# Altium schematic sheet ESP8862.SchDoc
size A4; SheetNumber: 3
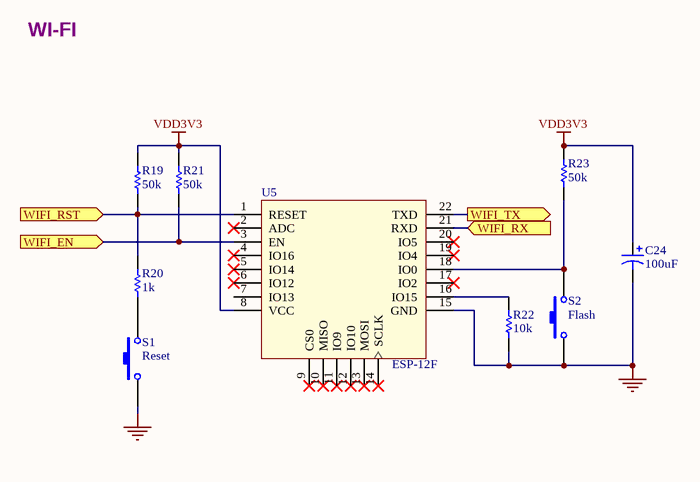
[diagram p0: ESP8862.SchDoc]

## Parts
C24  100uF  [AVX-B_TANTALUM-SMD-100UF-6.3V(AVX-B)(Primary)]
R19  50k  [RESC1608X55N]
R20  1k  [RESC1608X55N]
R21  50k  [RESC1608X55N]
R22  10k  [RESC1608X55N]
R23  50k  [RESC1608X55N]
S1  Reset  [SWITCH_4x6]
S2  Flash  [SWITCH_4x6]
U5  ESP-12F  [ESP_12_E]

## Ports
WIFI_EN (in), WIFI_RST (in), WIFI_RX (in), WIFI_TX (out)

## Nets
GND: C24.2 R22.1 S1.1 S2.1 U5.15(GND)
VDD3V3: C24.1 R19.2 R21.2 R23.2 U5.8(VCC)
WIFI_EN: R21.1 U5.3(EN) ; port WIFI_EN
WIFI_RST: R19.1 R20.2 U5.1(RESET) ; port WIFI_RST
WIFI_RX: U5.21(RXD) ; port WIFI_RX
WIFI_TX: U5.22(TXD) ; port WIFI_TX
NetR20_1: R20.1 S1.2
NetR22_2: R22.2 U5.16(IO15)
NetR23_1: R23.1 S2.2 U5.18(IO0)

Not connected (* = marked no-connect by the designer): U5 2(ADC)* 4(IO16)* 5(IO14)* 6(IO12)* 7(IO13) 9(CS0)* 10(MISO)* 11(IO9)* 12(IO10)* 13(MOSI)* 14(SCLK)* 17(IO2)* 19(IO4)* 20(IO5)*

## Notes on the sheet
- WI-FI

## Library data of the parts
C24 = Cap Pol2: Polarized Capacitor (Axial); Fabricant: AVX; Fabricant_REF: TAJB107M006RNJ; Fournisseur: Farnell; Fournisseur_REF: 1833917; Price: 0.914
R19-R21 R23 = Resistor: Fabricant: MULTICOMP; Fournisseur: Farnell
R22 = Resistor: Value: 1K; Published: 8-Jun-2000; LatestRevisionDate: 17-Jul-2002; LatestRevisionNote: Re-released for DXP Platform.; PackageReference: AXIAL-0.3; Publisher: Altium Limited; PackageDescription: Axial Device, Thru-Hole; 2 Leads; 0.3 in Pin Spacing
S1 S2 = SW-PB: Switch; Fabricant: FGHGF; Fabricant_REF: 1158238; Fournisseur: Aliexpress; Fournisseur_REF: 32788506240; Price: 0.0211
U5 = ESP-12F: Fabricant: ESPRESSIF; Fournisseur: Aliexpress; Fournisseur_REF: 32858988324; Price: 1.6; Fabricant_REF: ESP-12F